# Altium project PCB_Project.PrjPcb
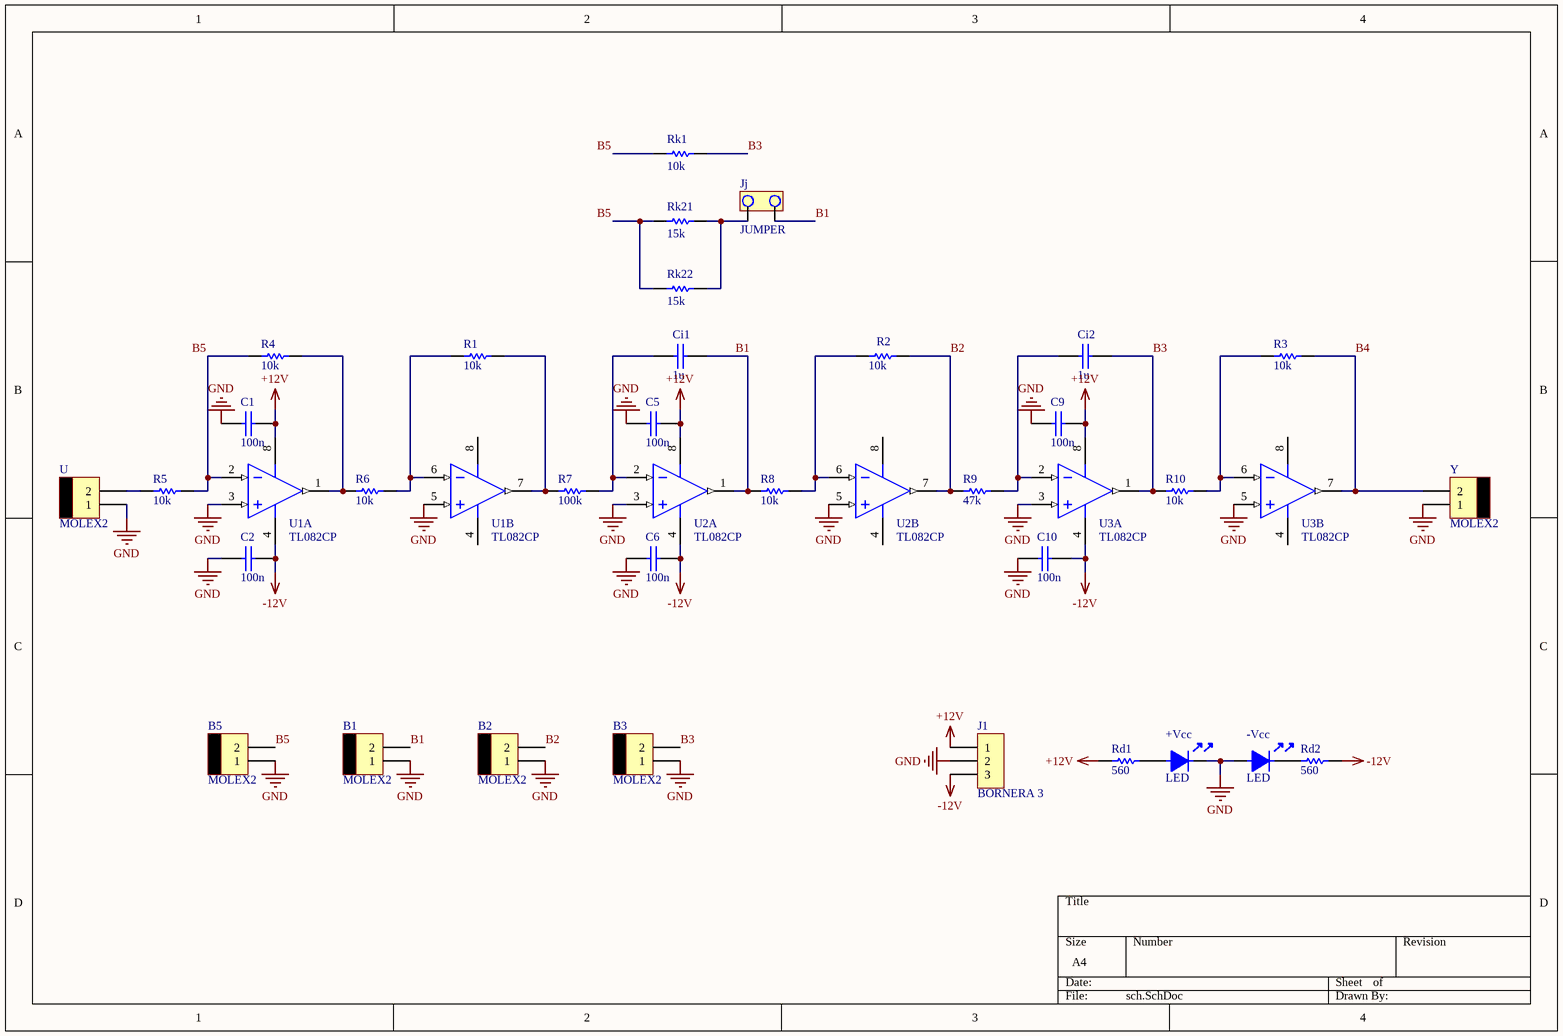
[diagram p0: sch.SchDoc]
1 sheet, 36 parts. Net scope: global (net labels, ports and power ports of the same name join across sheets).
Board file: pcb.PcbDoc

## Sheet sch.SchDoc
size A4; SheetNumber: 1; SheetTotal: 1

### Parts
+Vcc  LED  [LED3]
-Vcc  LED  [LED3]
B1  MOLEX2  [MOLEX2]
B2  MOLEX2  [MOLEX2]
B3  MOLEX2  [MOLEX2]
B5  MOLEX2  [MOLEX2]
C1  100n  [CAP200]
C2  100n  [CAP100]
C5  100n  [CAP200]
C6  100n  [CAP100]
C9  100n  [CAP200]
C10  100n  [CAP100]
Ci1  1u  [CAP100]
Ci2  1u  [CAP100]
J1  BORNERA 3  [BORNERA3]
Jj  JUMPER  [JUMPER2]
R1  10k  [RES300]
R2  10k  [RES300]
R3  10k  [RES300]
R4  10k  [RES300]
R5  10k  [RES300]
R6  10k  [RES300]
R7  100k  [RES300]
R8  10k  [RES300]
R9  47k  [RES300]
R10  10k  [RES300]
Rd1  560  [RES300]
Rd2  560  [RES300]
Rk1  10k  [RES300]
Rk21  15k  [RES300]
Rk22  15k  [RES400]
U  MOLEX2  [MOLEX2]
U1  TL082CP  [P0008A]  (parts A,B of 2)
U2  TL082CP  [P0008A]  (parts A,B of 2)
U3  TL082CP  [P0008A]  (parts A,B of 2)
Y  MOLEX2  [MOLEX2]

### Nets
+12V: C1.1 C5.1 C9.1 J1.1 Rd1.1 U1.8(VCC+) U2.8(VCC+) U3.8(VCC+)
-12V: C2.1 C6.1 C10.1 J1.3 Rd2.2 U1.4(VCC-) U2.4(VCC-) U3.4(VCC-)
GND: +Vcc.2 -Vcc.1 B1.1 B2.1 B3.1 B5.1 C1.2 C2.2 C5.2 C6.2 C9.2 C10.2 J1.2 U.1 U1.3(IN1+) U1.5(IN2+) U2.3(IN1+) U2.5(IN2+) U3.3(IN1+) U3.5(IN2+) Y.1
B1: B1.2 Ci1.1 Jj.1 R8.1 U2.1(OUT1)
B2: B2.2 R2.2 R9.1 U2.7(OUT2)
B3: B3.2 Ci2.1 R10.1 Rk1.2 U3.1(OUT1)
B4: R3.2 U3.7(OUT2) Y.2
B5: B5.2 R4.1 R5.2 Rk1.1 Rk21.1 Rk22.1 U1.2(IN1-)
Net+Vcc_1: +Vcc.1 Rd1.2
Net-Vcc_2: -Vcc.2 Rd2.1
NetCi1_2: Ci1.2 R7.2 U2.2(IN1-)
NetCi2_2: Ci2.2 R9.2 U3.2(IN1-)
NetJj_2: Jj.2 Rk21.2 Rk22.2
NetR1_1: R1.1 R6.2 U1.6(IN2-)
NetR1_2: R1.2 R7.1 U1.7(OUT2)
NetR2_1: R2.1 R8.2 U2.6(IN2-)
NetR3_1: R3.1 R10.2 U3.6(IN2-)
NetR4_2: R4.2 R6.1 U1.1(OUT1)
NetR5_1: R5.1 U.2

### Library data of the parts
C1 C2 C5 C6 C9 C10 Ci1 Ci2 = CAP
R1-R10 Rd1 Rd2 Rk1 Rk21 Rk22 = RES
U1-U3 = CMP-0055-00158-5: JFET-Input Operational Amplifier, 7 to 36 V, 0 to 70 degC, 8-pin DIP (P8), Pb-Free (RoHS); Manufacturer: Texas Instruments; Total Supply Voltage(Max)(+5V is 5, +/-5V is 10): 36; Rating: Catalog; Number of Channels: 2; Slew Rate(Typ)(V/us): 13; CMRR(Min)(dB): 70; Sub Family: General Purpose Amplifier, High Supply Voltage Amplifier (>=30V); Offset Drift(Typ)(uV/C): 18; Total Supply Voltage(Min)(+5V is 5, +/-5V is 10): 7; IIB(Max)(pA): 400; GBW(Typ)(MHz): 3; Iq per channel(Max)(mA): 2.8; Vio (25C)(Max)(mV): 15; PackageDescription: 8-Pin Plastic In-Line, Body 9.59 x 6.35 mm, Pitch 2.54 mm; ComponentLink2URL: http://www.ti.com/lit/ds/symlink/tl082.pdf; Mounting Technology: Through Hole; Code_JEDEC: MS-001; ComponentLink1Description: Manufacturer URL; ComponentLink3Description: Package Specification; PartNumber: TL082CP; PackageVersion: 4040082/E, 04/2010; Eco-Plan: Pb-Free (RoHS); ComponentLink1URL: http://www.ti.com/; PackageReference: P0008A; ComponentLink3URL: http://www.ti.com/litv/pdf/mpdi001b; DatasheetVersion: SLOS081G; ComponentLink2Description: Datasheet; Vn at 1kHz(Typ)(nV/rtHz): 18